# Altium project Arduino Shield.PrjPcb
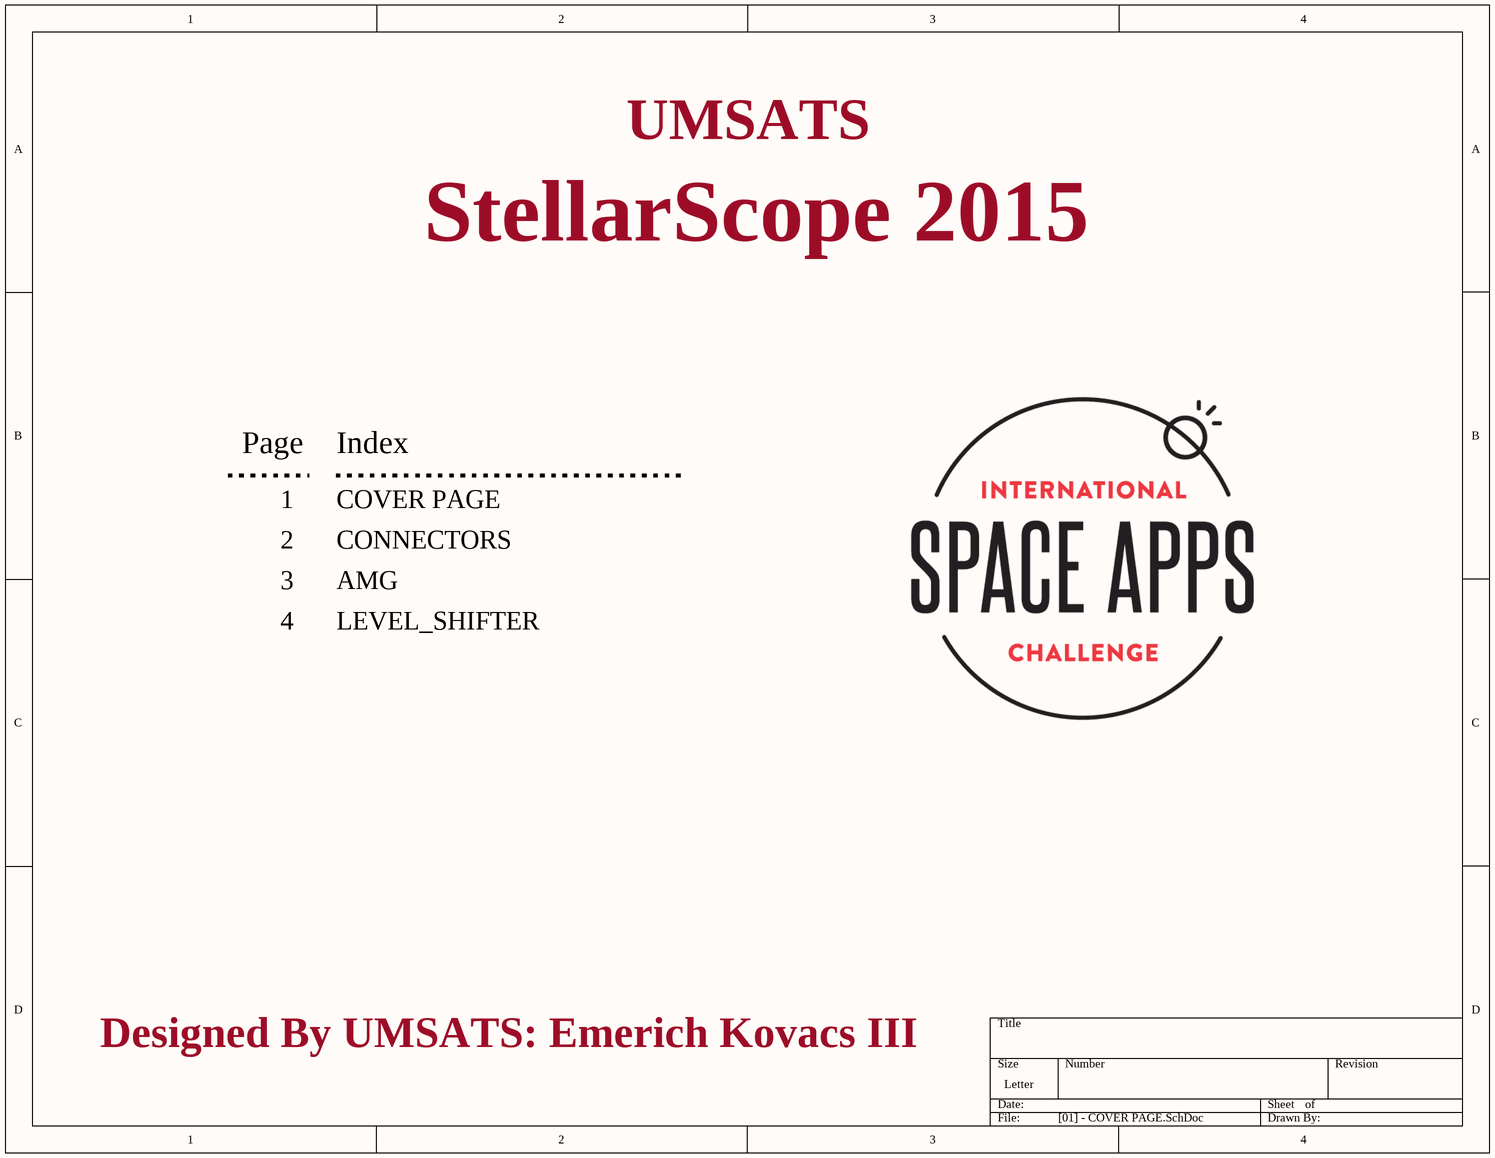
[diagram p0: [01] - COVER PAGE.SchDoc]
4 sheets, 21 parts. Net scope: flat (ports and power ports of the same name join across sheets).
Board file: Arduino Shield PCB.PcbDoc
Sheets:
  [01] - COVER PAGE.SchDoc
  [02] - CONNECTORS.SchDoc
  [03] - AMG.SchDoc
  [04] - LEVEL_SHIFTER.SchDoc

## Sheet [01] - COVER PAGE.SchDoc
size Letter

### Notes on the sheet
- UMSATS
- StellarScope 2015
- Page
- Index
- 1
- 2
- COVER PAGE
- CONNECTORS
- 3
- 4
- AMG
- LEVEL_SHIFTER
- Designed By UMSATS: Emerich Kovacs III

## Sheet [02] - CONNECTORS.SchDoc
size Letter
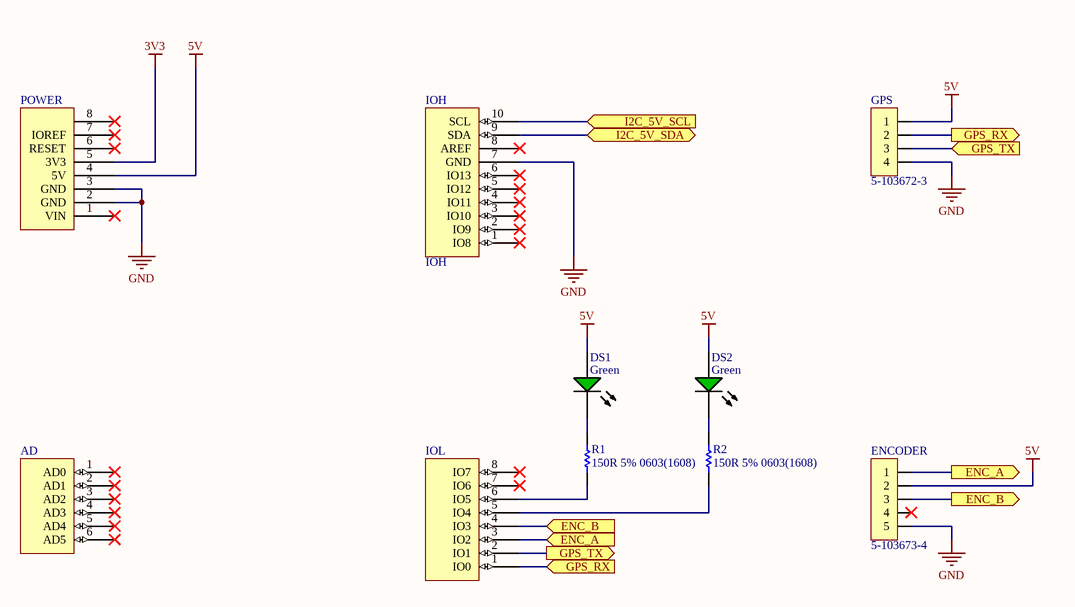
[diagram p1: [02] - CONNECTORS.SchDoc]

### Parts
AD  AD  [Header 6x1 8.5mm]  (value not drawn)
DS1  Color: Green  [KING-LED0603-25-GREEN_V]  (hidden comment: APG1608CGKC/T)
DS2  Color: Green  [KING-LED0603-25-GREEN_V]  (hidden comment: APG1608CGKC/T)
ENCODER  5-103673-4  [Header_5-103673-4_TE]
GPS  5-103672-3  [PCBComponent_1]
IOH  IOH  [Header 10x1 8.5mm]
IOL  IOL  [Header 8x1 8.5mm]  (value not drawn)
POWER  POWER_UNO  [Header 8x1 8.5mm]  (value not drawn)
R1  150R 5% 0603(1608)  [RESC0603(1608)_L]
R2  150R 5% 0603(1608)  [RESC0603(1608)_L]

### Ports
ENC_A (in), ENC_A (out), ENC_B (in), ENC_B (out), GPS_RX (in), GPS_RX (out), GPS_TX (in), GPS_TX (out), I2C_5V_SCL (in), I2C_5V_SDA (bidir)

### Nets
3V3: POWER.5(3V3)
5V: DS1.1(A) DS2.1(A) ENCODER.2 GPS.1 POWER.4(5V)
GND: ENCODER.5 GPS.4 IOH.7(GND) POWER.2(GND) POWER.3(GND)
NetDS1_2: DS1.2(K) R1.1
NetDS2_2: DS2.2(K) R2.1
NetENCODER_1: ENCODER.1 IOL.3(IO2) ; port ENC_A
NetENCODER_3: ENCODER.3 IOL.4(IO3) ; port ENC_B
NetGPS_2: GPS.2 IOL.1(IO0) ; port GPS_RX
NetGPS_3: GPS.3 IOL.2(IO1) ; port GPS_TX
NetIOH_9: IOH.9(SDA) ; port I2C_5V_SDA
NetIOH_10: IOH.10(SCL) ; port I2C_5V_SCL
NetIOL_5: IOL.5(IO4) R2.2
NetIOL_6: IOL.6(IO5) R1.2

Not connected (* = marked no-connect by the designer): AD 1(AD0)* 2(AD1)* 3(AD2)* 4(AD3)* 5(AD4)* 6(AD5)*; ENCODER 4*; IOH 1(IO8)* 2(IO9)* 3(IO10)* 4(IO11)* 5(IO12)* 6(IO13)* 8(AREF)*; IOL 7(IO6)* 8(IO7)*; POWER 1(VIN)* 6(RESET)* 7(IOREF)* 8*

### Library data of the parts
DS1 DS2 = CMP-0239-00001-1: LED, SMT, 0603(1608), 0.25mm Thickness, Green; Manufacturer Part Number: APT1608MGC; Forward Current: 30 mA; Reverse Voltage: 5 V; Power Dissipation: 78 mW; Packing: Reel; ComponentLink1Description: Manufacturer URL; ComponentLink1URL: http://www.kingbrightusa.com/; ComponentLink2URL: http://www.kingbrightusa.com/images/catalog/SPEC/APG1608CGKC-T.pdf; Mounting Technology: Surface Mount; Storage Temperature: -40 to 85 degC; DatasheetVersion: Rev. 5B, 10/2012; PartNumber: APG1608CGKC/T; PackageReference: LED0603-25-GREEN; ComponentLink2Description: Datasheet; PackageDescription: 2-Pin SMT LED, 1.6 x 0.8 mm Body, 0.25mm Thickness; PackageVersion: Rev. 5B, 10/2012; Digi-key Part Number: 754-1118-1-ND
ENCODER = Header_5-103673-4_TE
GPS = Header_5-103672-3_TE
R1 R2 = CMP-1012-00054-1: 150R 0.1W 5% 0603 (1608 Metric)  SMD; Case-EIA: 0603; Value: 150.00 Ohm; Case-Metric: 1608; Tolerance: 5 %; Technology: SMT; Power: 0.1 W; Digi-Key Part Number: 311-150GRCT-ND

## Sheet [03] - AMG.SchDoc
size Letter
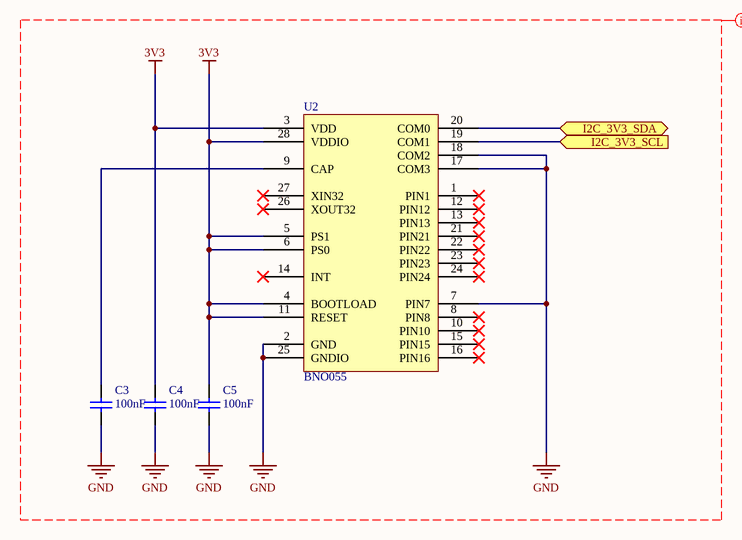
[diagram p2: [03] - AMG.SchDoc]

### Parts
C3  value 100nF  [CAPC0603(1608)100_L]  (hidden comment: CAP 100nF 50V 0603(1608))
C4  value 100nF  [CAPC0603(1608)100_L]  (hidden comment: CAP 100nF 50V 0603(1608))
C5  value 100nF  [CAPC0603(1608)100_L]  (hidden comment: CAP 100nF 50V 0603(1608))
U2  BNO055  [BNO055]

### Ports
I2C_3V3_SCL (in), I2C_3V3_SDA (bidir)

### Nets
3V3: C4.2 C5.2 U2.3(VDD) U2.4(BOOTLOAD) U2.5(PS1) U2.6(PS0) U2.11(RESET) U2.28(VDDIO)
GND: C3.1 C4.1 C5.1 U2.2(GND) U2.7(PIN7) U2.17(COM3) U2.18(COM2) U2.25(GNDIO)
NetC3_2: C3.2 U2.9(CAP)
NetR5_2: U2.19(COM1) ; port I2C_3V3_SCL
NetR6_2: U2.20(COM0) ; port I2C_3V3_SDA

Not connected (* = marked no-connect by the designer): U2 1(PIN1)* 8(PIN8)* 10(PIN10)* 12(PIN12)* 13(PIN13)* 14(INT)* 15(PIN15)* 16(PIN16)* 21(PIN21)* 22(PIN22)* 23(PIN23)* 24(PIN24)* 26(XOUT32)* 27(XIN32)*

### Layout directives
net class IMU Sensor: 3V3, GND

### Library data of the parts
C3-C5 = CMP-1035-02592-1: CAP 100nF 50V ±10% 0603 (1608 Metric) Thickness 1mm SMD; Manufacturer Part Number: C0603C104K5RACAUTO; Case-EIA: 0603; Case-Metric: 1608; Max Thickness: 1 mm; Tolerance: ±10%; Technology: SMT; Rated Voltage: 50 V; Digi-key Part Number: 399-6856-1-ND

## Sheet [04] - LEVEL_SHIFTER.SchDoc
size Letter
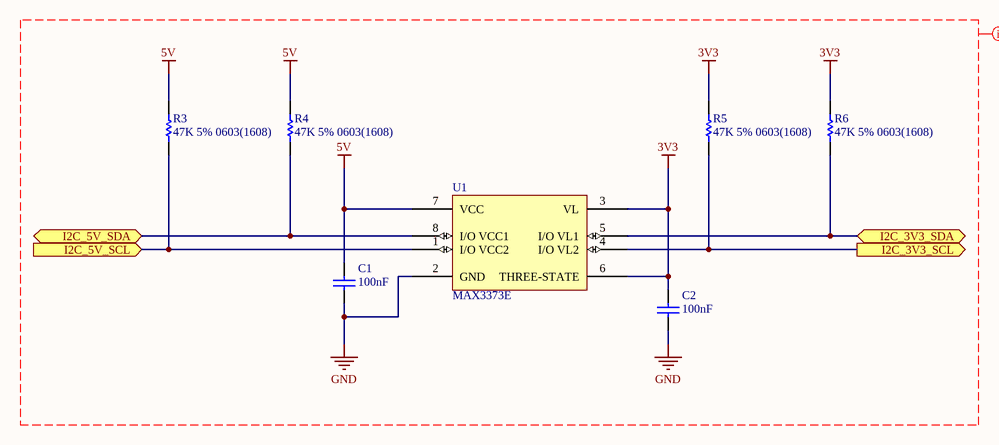
[diagram p3: [04] - LEVEL_SHIFTER.SchDoc]

### Parts
C1  value 100nF  [CAPC0603(1608)100_L]  (hidden comment: CAP 100nF 50V 0603(1608))
C2  value 100nF  [CAPC0603(1608)100_L]  (hidden comment: CAP 100nF 50V 0603(1608))
R3  47K 5% 0603(1608)  [RESC0603(1608)_L]
R4  47K 5% 0603(1608)  [RESC0603(1608)_L]
R5  47K 5% 0603(1608)  [RESC0603(1608)_L]
R6  47K 5% 0603(1608)  [RESC0603(1608)_L]
U1  MAX3373E  [MAX3373E]

### Ports
I2C_3V3_SCL (out), I2C_3V3_SDA (bidir), I2C_5V_SCL (in), I2C_5V_SDA (bidir)

### Nets
3V3: C2.2 R5.1 R6.1 U1.3(VL) U1.6(THREE-STATE)
5V: C1.2 R3.1 R4.1 U1.7(VCC)
GND: C1.1 C2.1 U1.2(GND)
NetIOH_9: R4.2 U1.8(I/O_VCC1) ; port I2C_5V_SDA
NetIOH_10: R3.2 U1.1(I/O_VCC2) ; port I2C_5V_SCL
NetR5_2: R5.2 U1.4(I/O_VL2) ; port I2C_3V3_SCL
NetR6_2: R6.2 U1.5(I/O_VL1) ; port I2C_3V3_SDA

### Layout directives
net class I2C Level Shifter: 3V3, 5V, GND

### Library data of the parts
C1 C2 = CMP-1035-02592-1: as C3 on sheet [03] - AMG; Max Thickness: 1 mm; Tolerance: ±10%; Technology: SMT; Rated Voltage: 50 V; Digi-key Part Number: 399-6856-1-ND
R3-R6 = CMP-1012-00114-1: 47K 0.1W 5% 0603 (1608 Metric)  SMD; Case-EIA: 0603; Value: 47000.00 Ohm; Case-Metric: 1608; Tolerance: 5 %; Technology: SMT; Power: 0.1 W; Digi-Key Part Number: 311-47KGRCT-ND

## Nets that join several sheets
3V3: [02] - CONNECTORS (POWER.5), [03] - AMG (8 pins), [04] - LEVEL_SHIFTER (5 pins)
5V: [02] - CONNECTORS (5 pins), [04] - LEVEL_SHIFTER (C1.2 R3.1 R4.1 U1.7)
GND: [02] - CONNECTORS (5 pins), [03] - AMG (8 pins), [04] - LEVEL_SHIFTER (C1.1 C2.1 U1.2)
NetIOH_9: [02] - CONNECTORS (IOH.9), [04] - LEVEL_SHIFTER (R4.2 U1.8)
NetIOH_10: [02] - CONNECTORS (IOH.10), [04] - LEVEL_SHIFTER (R3.2 U1.1)
NetR5_2: [03] - AMG (U2.19), [04] - LEVEL_SHIFTER (R5.2 U1.4)
NetR6_2: [03] - AMG (U2.20), [04] - LEVEL_SHIFTER (R6.2 U1.5)